# Altium schematic sheet Modular_BO.SchDoc
size C; SheetNumber: 1; SheetTotal: 1
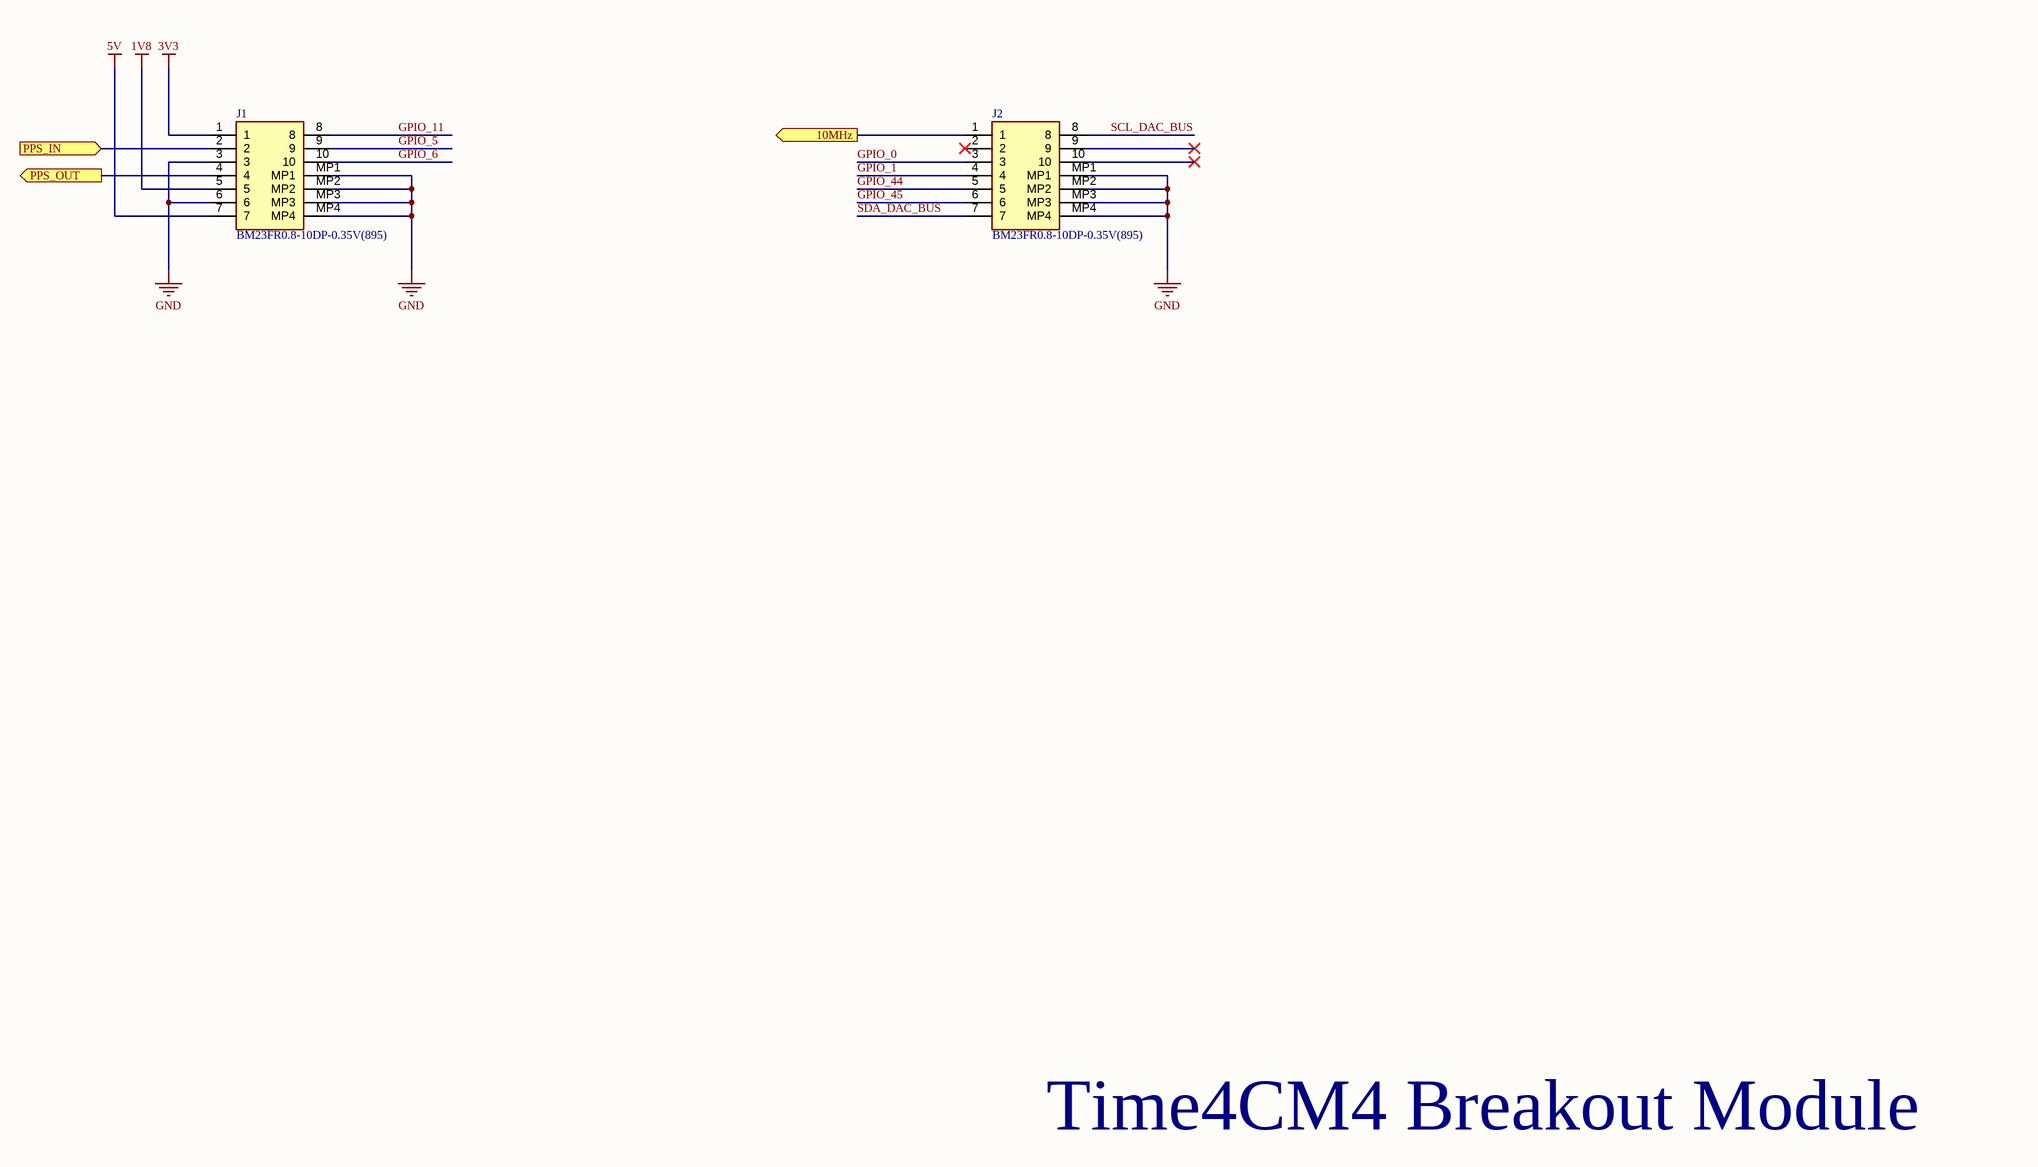
[diagram p0: Modular_BO.SchDoc]

## Parts
J1  BM23FR0.8-10DP-0.35V(895)  [BM23FR0810DP035V895]
J2  BM23FR0.8-10DP-0.35V(895)  [BM23FR0810DP035V895]

## Ports
10MHz (out), PPS_IN (in), PPS_OUT (out)

## Nets
1V8: J1.5
3V3: J1.1
5V: J1.7
GND: J1.3 J1.6 J1.MP1 J1.MP2 J1.MP3 J1.MP4 J2.MP1 J2.MP2 J2.MP3 J2.MP4
10MHz: J2.1 ; port 10MHz
GPIO_0: J2.3
GPIO_1: J2.4
GPIO_5: J1.9
GPIO_6: J1.10
GPIO_11: J1.8
GPIO_44: J2.5
GPIO_45: J2.6
PPS_IN: J1.2 ; port PPS_IN
PPS_OUT: J1.4 ; port PPS_OUT
SCL_DAC_BUS: J2.8
SDA_DAC_BUS: J2.7

Not connected (* = marked no-connect by the designer): J2 2* 9* 10*

## Notes on the sheet
- Time4CM4 Breakout Module
- DWG. NO.
- REV.
- SHT.
- REVISION
- DESCRIPTION
- DATE
- APPROVED
- THIS DOCUMENT AND THE DATA DISCLOSED HEREIN OR HEREWITH IS THE PROPERTY OF ALTIUM LIMITED AND MAY BE FREELY DISTRIBUTED IN WHOLE. NO RIGHTS ARE RESERVED OR EXPRESS OR IMPLIED WARANTEE GIVEN.
- ENG:
- DSN:
- APPROVALS
- PROJECT
- DOCUMENT REVISION:
- DESIGN ITEM:
- CHK:
- BOM:
- REFERENCE DOCUMENTS
- PROJECT REVISION:
- TITLE
- FAB DWG:
- PCB DWG:
- ASSY DWG:
- SCALE:
- SIZE
- C
- CAGE CODE
- FILE NAME
- DWG NO.
- SHEET
- OF
- REV

## Library data of the parts
J1 J2 = BM23FR0.8-10DS-0.35V_895_: Connector; Manufacturer_Name: Hirose; Manufacturer_Part_Number: BM23FR0.8-10DS-0.35V(895); Datasheet Link: https://componentsearchengine.com/Datasheets/1/BM23FR0.8-10DS-0.35V(895).pdf; Height: 0.9mm; Mouser Part Number: 798-3FR0810DS035V895; Mouser Price/Stock: https://www.mouser.co.uk/ProductDetail/Hirose-Connector/BM23FR08-10DS-035V895/?qs=YCa%2FAAYMW01IXWgIGURT8A%3D%3D